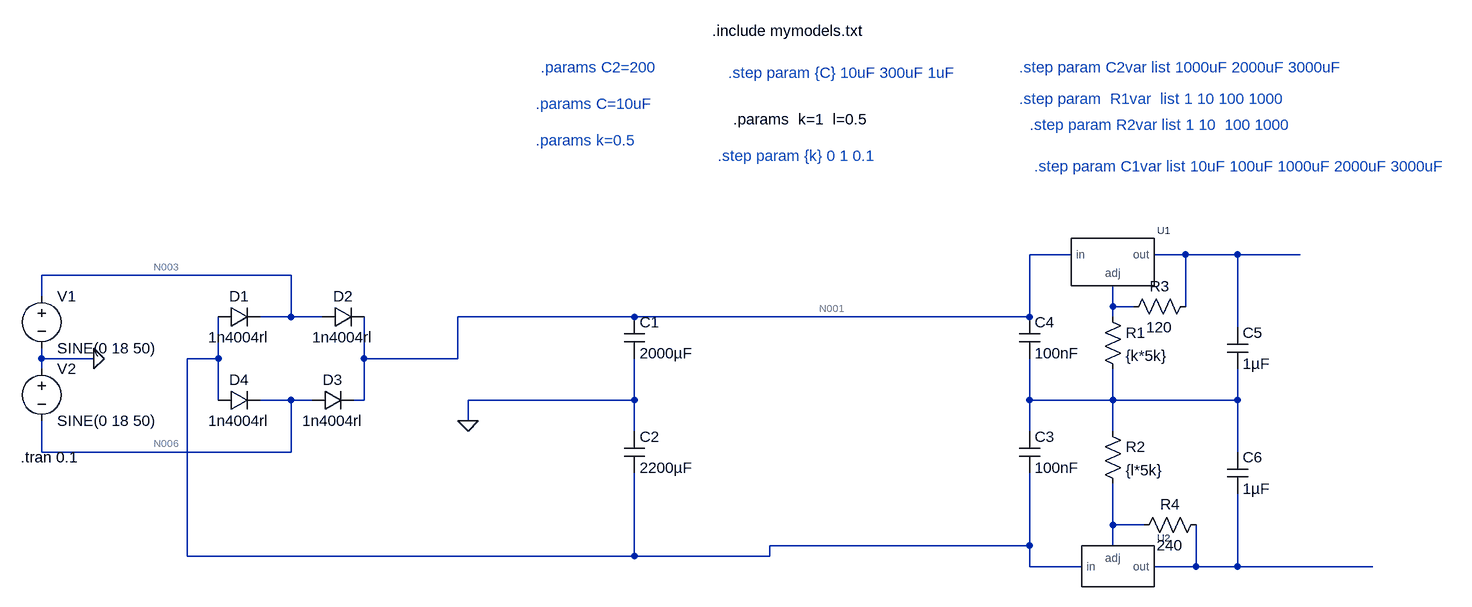
[diagram p0: schematic Draft1.asc]
Draft1.asc, the LTspice schematic file:
Version 4
SHEET 1 1852 680
WIRE 1216 -16 1152 -16
WIRE 1392 -16 1344 -16
WIRE 1472 -16 1392 -16
WIRE 1568 -16 1472 -16
WIRE 16 16 -368 16
WIRE -368 48 -368 16
WIRE 1280 64 1280 32
WIRE 1312 64 1280 64
WIRE 1392 64 1392 -16
WIRE 16 80 16 16
WIRE 16 80 -32 80
WIRE 64 80 16 80
WIRE 544 80 272 80
WIRE 1152 80 1152 -16
WIRE 1152 80 544 80
WIRE 1280 80 1280 64
WIRE 1472 96 1472 -16
WIRE -368 144 -368 128
WIRE -288 144 -368 144
WIRE -96 144 -96 80
WIRE -96 144 -144 144
WIRE 128 144 128 80
WIRE 272 144 272 80
WIRE 272 144 128 144
WIRE -368 160 -368 144
WIRE -96 208 -96 144
WIRE 16 208 -32 208
WIRE 48 208 16 208
WIRE 128 208 128 144
WIRE 128 208 112 208
WIRE 544 208 544 144
WIRE 544 208 288 208
WIRE 1152 208 1152 144
WIRE 1280 208 1280 160
WIRE 1280 208 1152 208
WIRE 1472 208 1472 160
WIRE 1472 208 1280 208
WIRE 288 240 288 208
WIRE 544 256 544 208
WIRE 1152 256 1152 208
WIRE 1280 256 1280 208
WIRE -368 288 -368 240
WIRE 16 288 16 208
WIRE 16 288 -368 288
WIRE 1472 288 1472 208
WIRE 1280 400 1280 336
WIRE 1328 400 1280 400
WIRE 1152 432 1152 320
WIRE 1152 432 752 432
WIRE 1280 432 1280 400
WIRE -144 448 -144 144
WIRE 544 448 544 320
WIRE 544 448 -144 448
WIRE 752 448 752 432
WIRE 752 448 544 448
WIRE 1152 464 1152 432
WIRE 1232 464 1152 464
WIRE 1408 464 1408 400
WIRE 1408 464 1344 464
WIRE 1472 464 1472 352
WIRE 1472 464 1408 464
WIRE 1680 464 1472 464
FLAG -288 144 0
FLAG 288 240 0
SYMBOL voltage -368 32 R0
WINDOW 123 0 0 Left 2
WINDOW 39 0 0 Left 2
SYMATTR InstName V1
SYMATTR Value SINE(0 18 50)
SYMBOL voltage -368 144 R0
WINDOW 123 0 0 Left 2
WINDOW 39 0 0 Left 2
SYMATTR InstName V2
SYMATTR Value SINE(0 18 50)
SYMBOL diode -96 96 R270
WINDOW 0 32 32 VTop 2
WINDOW 3 0 32 VBottom 2
SYMATTR InstName D1
SYMATTR Value 1n4004rl
SYMBOL diode 64 96 R270
WINDOW 0 32 32 VTop 2
WINDOW 3 0 32 VBottom 2
SYMATTR InstName D2
SYMATTR Value 1n4004rl
SYMBOL diode 48 224 R270
WINDOW 0 32 32 VTop 2
WINDOW 3 0 32 VBottom 2
SYMATTR InstName D3
SYMATTR Value 1n4004rl
SYMBOL diode -96 224 R270
WINDOW 0 32 32 VTop 2
WINDOW 3 0 32 VBottom 2
SYMATTR InstName D4
SYMATTR Value 1n4004rl
SYMBOL cap 528 80 R0
SYMATTR InstName C1
SYMATTR Value 2000µF
SYMBOL cap 528 256 R0
SYMATTR InstName C2
SYMATTR Value 2200µF
SYMBOL cap 1136 256 R0
SYMATTR InstName C3
SYMATTR Value 100nF
SYMBOL cap 1136 80 R0
SYMATTR InstName C4
SYMATTR Value 100nF
SYMBOL cap 1456 96 R0
SYMATTR InstName C5
SYMATTR Value 1µF
SYMBOL cap 1456 288 R0
SYMATTR InstName C6
SYMATTR Value 1µF
SYMBOL regulator 1280 -16 R0
SYMATTR InstName U1
SYMATTR Prefix X
SYMATTR Value LM317
SYMBOL res 1264 64 R0
SYMATTR InstName R1
SYMATTR Value {k*5k}
SYMBOL res 1264 240 R0
SYMATTR InstName R2
SYMATTR Value {l*5k}
SYMBOL res 1408 48 R90
WINDOW 0 0 56 VBottom 2
WINDOW 3 32 56 VTop 2
SYMATTR InstName R3
SYMATTR Value 120
SYMBOL regular2 1280 464 R0
SYMATTR InstName U2
SYMATTR Prefix X
SYMATTR Value LM337_N_TRANS
SYMBOL res 1424 384 R90
WINDOW 0 0 56 VBottom 2
WINDOW 3 32 56 VTop 2
SYMATTR InstName R4
SYMATTR Value 240
TEXT -400 296 Left 2 !.tran 0.1
TEXT 664 -360 Left 2 !.include mymodels.txt
TEXT 672 -168 Left 2 ;.step param {k} 0 1 0.1
TEXT 392 -192 Left 2 ;.params k=0.5
TEXT 392 -248 Left 2 ;.params C=10uF
TEXT 400 -304 Left 2 ;.params C2=200
TEXT 696 -224 Left 2 !.params  k=1  l=0.5
TEXT 1136 -256 Left 2 ;.step param  R1var  list 1 10 100 1000
TEXT 1152 -216 Left 2 ;.step param R2var list 1 10  100 1000
TEXT 1480 -152 Center 2 ;.step param C1var list 10uF 100uF 1000uF 2000uF 3000uF
TEXT 1136 -304 Left 2 ;.step param C2var list 1000uF 2000uF 3000uF
TEXT 688 -296 Left 2 ;.step param {C} 10uF 300uF 1uF

The netlist it stands for:
* Draft1.asc
V1 N003 0 SINE(0 18 50)
V2 0 N006 SINE(0 18 50)
D1 N005 N003 1n4004rl
D2 N003 N001 1n4004rl
D3 N006 N001 1n4004rl
D4 N005 N006 1n4004rl
C1 N001 0 2000µF
C2 0 N005 2200µF
C3 N007 N005 100nF
C4 N001 N007 100nF
C5 N002 N007 1µF
C6 N007 N009 1µF
XU1 N001 N004 N002 regulator params: LM317  ; pins in adj out
R1 N004 N007 {k*5k}
R2 N007 N008 {l*5k}
R3 N002 N004 120
XU2 N008 N005 N009 regular2 params: LM337_N_TRANS  ; pins adj in out
R4 N009 N008 240
.model D D
.lib standard.dio
.tran 0.1
.include mymodels.txt
* .step param {k} 0 1 0.1
* .params k=0.5
* .params C=10uF
* .params C2=200
.params  k=1  l=0.5
* .step param  R1var  list 1 10 100 1000
* .step param R2var list 1 10  100 1000
* .step param C1var list 10uF 100uF 1000uF 2000uF 3000uF
* .step param C2var list 1000uF 2000uF 3000uF
* .step param {C} 10uF 300uF 1uF
.backanno
.end

* Results of the author's LTspice run, read from the files saved beside the schematic
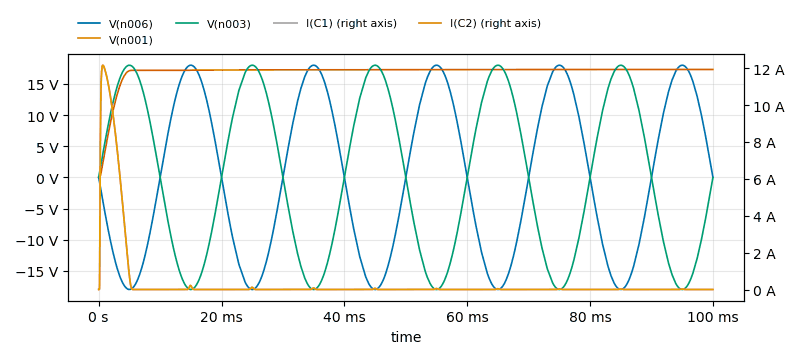
[diagram p1: Transient Analysis of Draft1.asc, plotted from the saved traces]
* Transient Analysis, 1 run:
*   V(n006): min -18 V, max 18 V, average 1.026 mV, rms 12.74 V, last 0 V
*   V(n001): min 0 V, max 17.32 V, average 16.92 V, rms 17.03 V, last 17.32 V
*   V(n003): min -18 V, max 18 V, average -1.026 mV, rms 12.74 V, last 0 V
*   I(C1): min -11.73 µA, max 12.16 A, average 381 mA, rms 1.881 A, last 0 A
*   I(C2): min -10.05 µA, max 12.16 A, average 381 mA, rms 1.881 A, last 0 A